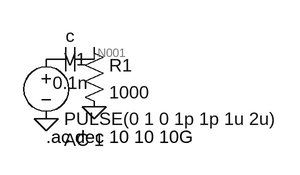
[diagram p0: schematic Draft4.asc]
Draft4.asc, the LTspice schematic file:
Version 4
SHEET 1 880 680
WIRE 32 96 32 80
FLAG 32 160 0
FLAG -32 176 0
SYMBOL voltage -32 80 R0
WINDOW 123 24 124 Left 2
WINDOW 39 0 0 Left 0
SYMATTR InstName V1
SYMATTR Value PULSE(0 1 0 1p 1p 1u 2u)
SYMATTR Value2 AC 1
SYMBOL cap 32 80 R90
WINDOW 0 0 32 VBottom 2
WINDOW 3 32 32 VTop 2
SYMATTR InstName c
SYMATTR Value 0.1n
SYMBOL res 16 64 R0
SYMATTR InstName R1
SYMATTR Value 1000
TEXT -32 200 Left 2 !.ac dec 10 10 10G

The netlist it stands for:
* Draft4.asc
V1 P001 0 PULSE(0 1 0 1p 1p 1u 2u) AC 1
c N001 P001 0.1n
R1 N001 0 1000
.ac dec 10 10 10G
.backanno
.end

* Results of the author's LTspice run, read from the files saved beside the schematic
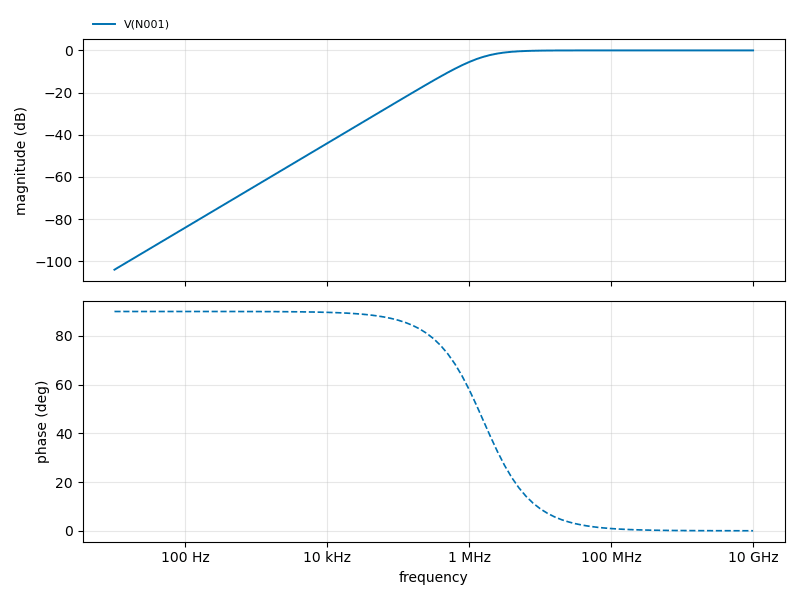
[diagram p1: AC Analysis of Draft4.asc, plotted from the saved traces]
* AC Analysis, 1 run:
*   V(N001): -104.04 dB at 10 Hz, -0.00 dB at 10 GHz, peak -0.00 dB at 10 GHz, 3 dB below the peak at 1.592 MHz